# Altium schematic sheet SPI Encoders.SchDoc: Arm - SPI Encoders
size Letter; DrawnBy: N.Chapman, K.Hong; Organization: UW Robotics; Address1: 200 University Avenue; Address2: Waterloo; Address3: Ontario; Address4: Canada N2L 3G6; SheetNumber: 9; SheetTotal: 9
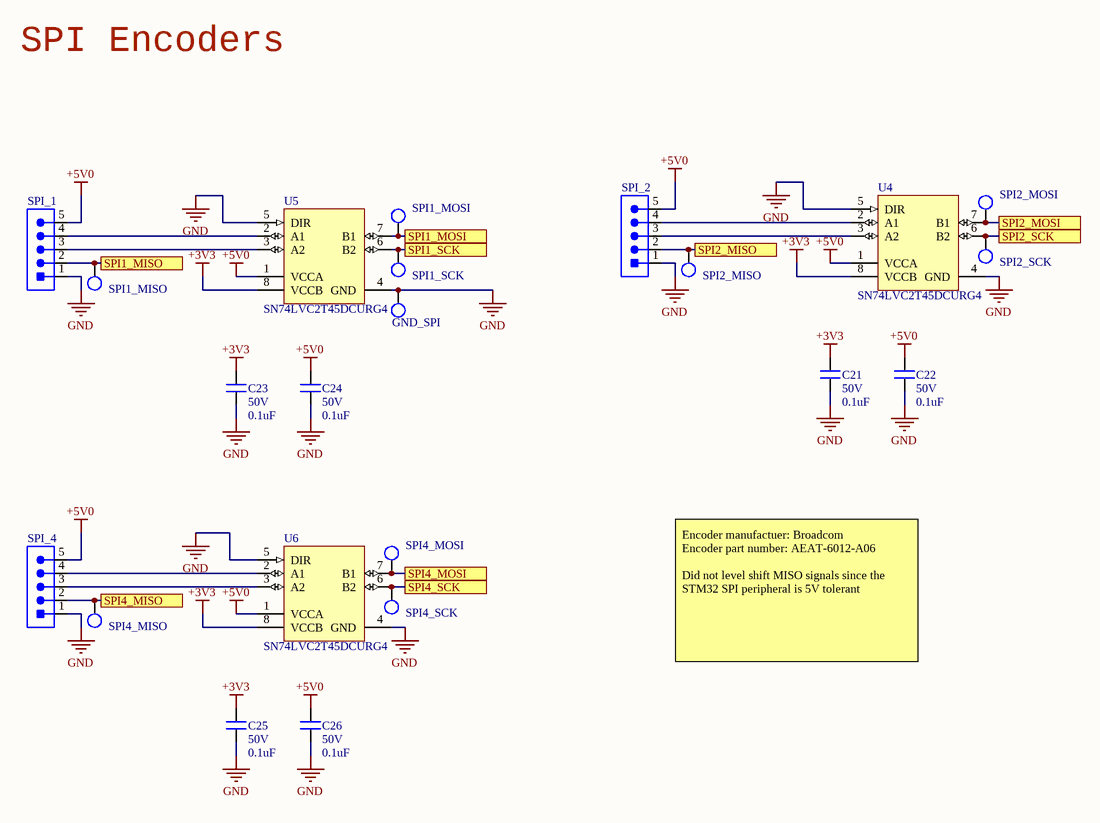
[diagram p0: SPI Encoders.SchDoc]

## Parts
C21  value 0.1uF  Voltage Rating: 50V  [CAPC0603(1608)55_N]  (hidden comment: CAP_0.1uF_50V_0603)
C22  value 0.1uF  Voltage Rating: 50V  [CAPC0603(1608)55_N]  (hidden comment: CAP_0.1uF_50V_0603)
C23  value 0.1uF  Voltage Rating: 50V  [CAPC0603(1608)55_N]  (hidden comment: CAP_0.1uF_50V_0603)
C24  value 0.1uF  Voltage Rating: 50V  [CAPC0603(1608)55_N]  (hidden comment: CAP_0.1uF_50V_0603)
C25  value 0.1uF  Voltage Rating: 50V  [CAPC0603(1608)55_N]  (hidden comment: CAP_0.1uF_50V_0603)
C26  value 0.1uF  Voltage Rating: 50V  [CAPC0603(1608)55_N]  (hidden comment: CAP_0.1uF_50V_0603)
GND_SPI  TESTPOINT_LOOP  [TESTPOINT_LOOP]  (value not drawn)
SPI1_MISO  TESTPOINT_LOOP  [TESTPOINT_LOOP]  (value not drawn)
SPI1_MOSI  TESTPOINT_LOOP  [TESTPOINT_LOOP]  (value not drawn)
SPI1_SCK  TESTPOINT_LOOP  [TESTPOINT_LOOP]  (value not drawn)
SPI2_MISO  TESTPOINT_LOOP  [TESTPOINT_LOOP]  (value not drawn)
SPI2_MOSI  TESTPOINT_LOOP  [TESTPOINT_LOOP]  (value not drawn)
SPI2_SCK  TESTPOINT_LOOP  [TESTPOINT_LOOP]  (value not drawn)
SPI4_MISO  TESTPOINT_LOOP  [TESTPOINT_LOOP]  (value not drawn)
SPI4_MOSI  TESTPOINT_LOOP  [TESTPOINT_LOOP]  (value not drawn)
SPI4_SCK  TESTPOINT_LOOP  [TESTPOINT_LOOP]  (value not drawn)
SPI_1  CON_5M_SM4  [JST-B5B-SM4-TB]  (value not drawn)
SPI_2  CON_5M_SM4  [JST-B5B-SM4-TB]  (value not drawn)
SPI_4  CON_5M_SM4  [JST-B5B-SM4-TB]  (value not drawn)
U4  SN74LVC2T45DCURG4  [DCU0008A_N]
U5  SN74LVC2T45DCURG4  [DCU0008A_N]
U6  SN74LVC2T45DCURG4  [DCU0008A_N]

## Ports
SPI1_MISO, SPI1_MOSI, SPI1_SCK, SPI2_MISO, SPI2_MOSI, SPI2_SCK, SPI4_MISO, SPI4_MOSI, SPI4_SCK

## Nets
+3V3: C21.2 C23.2 C25.2 U4.8(VCCB) U5.8(VCCB) U6.8(VCCB)
+5V0: C22.2 C24.2 C26.2 SPI_1.5 SPI_2.5 SPI_4.5 U4.1(VCCA) U5.1(VCCA) U6.1(VCCA)
GND: C21.1 C22.1 C23.1 C24.1 C25.1 C26.1 GND_SPI.1 SPI_1.1 SPI_2.1 SPI_4.1 U4.4(GND) U4.5(DIR) U5.4(GND) U5.5(DIR) U6.4(GND) U6.5(DIR)
SPI1_MISO: SPI1_MISO.1 SPI_1.2 ; port SPI1_MISO
SPI1_MOSI: SPI1_MOSI.1 U5.7(B1) ; port SPI1_MOSI
SPI1_SCK: SPI1_SCK.1 U5.6(B2) ; port SPI1_SCK
SPI2_MISO: SPI2_MISO.1 SPI_2.2 ; port SPI2_MISO
SPI2_MOSI: SPI2_MOSI.1 U4.7(B1) ; port SPI2_MOSI
SPI2_SCK: SPI2_SCK.1 U4.6(B2) ; port SPI2_SCK
SPI4_MISO: SPI4_MISO.1 SPI_4.2 ; port SPI4_MISO
SPI4_MOSI: SPI4_MOSI.1 U6.7(B1) ; port SPI4_MOSI
SPI4_SCK: SPI4_SCK.1 U6.6(B2) ; port SPI4_SCK
NetSPI_1_3: SPI_1.3 U5.3(A2)
NetSPI_1_4: SPI_1.4 U5.2(A1)
NetSPI_2_3: SPI_2.3 U4.3(A2)
NetSPI_2_4: SPI_2.4 U4.2(A1)
NetSPI_4_3: SPI_4.3 U6.3(A2)
NetSPI_4_4: SPI_4.4 U6.2(A1)

## Notes on the sheet
- SPI Encoders
- Encoder manufactuer: Broadcom
  Encoder part number: AEAT-6012-A06
  Did not level shift MISO signals since the STM32 SPI peripheral is 5V tolerant
- Title
- Size:
- Date:
- Letter
- Drawn By:
- Sheet
- of
- File:

## Library data of the parts
C21-C26 = CAP_0.1uF_50V_0603: CAP CER 0.1UF 50V X7R 0603; MPN: CC0603KRX7R9BB104; Manufacturer: Yageo; Dimensions: 0.063" L x 0.031" W (1.60mm x 0.80mm); Package: 0603 (1608 Metric); Temperature Coefficient: X7R; Supplier Part Number 1: 311-1344-1-ND; Supplier 1: Digi-Key
GND_SPI SPI1_MISO SPI1_MOSI SPI1_SCK SPI2_MISO SPI2_MOSI SPI2_SCK SPI4_MISO SPI4_MOSI SPI4_SCK = TESTPOINT_LOOP: Loop testpoint through-hole pad; Manufacturer: Keystone Electronics; Manufacturer Part Number 1: 5002; Supplier Part Number 1: 36-5002-ND; Supplier 1: Digi-Key
SPI_1 SPI_2 SPI_4 = CON_5M_SM4: CONN HEADER SMD 5POS 2MM; Manufacturer: JST; Manufacturer Part Number: B5B-PH-SM4-TB(LF)(SN); Max Current Rating: 2A; Max Voltage Rating: 100V; Supplier 1: Digi-Key; ComponentLink1URL: https://datasheet.ciiva.com/11749/0900766b80ddea81-11749188.pdf?src-supplier=RSComponents; ComponentLink1Description: https://datasheet.ciiva.com/11749/0900766b80ddea81-11749188.pdf?src-supplier=RSComponents; ComponentLink2URL: https://datasheet.ciiva.com/712/eph-712595.pdf?src-supplier=Digi-Key; ComponentLink2Description: https://datasheet.ciiva.com/712/eph-712595.pdf?src-supplier=Digi-Key; ComponentLink3URL: https://datasheet.ciiva.com/712/eph-712596.pdf?src-supplier=Digi-Key; ComponentLink3Description: https://datasheet.ciiva.com/712/eph-712596.pdf?src-supplier=Digi-Key; ComponentLink4URL: https://datasheet.ciiva.com/730/eph-730612.pdf?src-supplier=Digi-Key; ComponentLink4Description: https://datasheet.ciiva.com/730/eph-730612.pdf?src-supplier=Digi-Key; ComponentLink5URL: https://datasheet.ciiva.com/16344/eph-16344920.pdf?src-supplier=Future+Electronics; ComponentLink5Description: https://datasheet.ciiva.com/16344/eph-16344920.pdf?src-supplier=Future+Electronics; Supplier Part Number 1: 455-1737-1-ND; Pitch: 2mm
U4-U6 = CMP-0859-00013-4: Dual-Bit Dual Supply Transceiver with Configurable Voltage Translation and 3-State Outputs, DCU0008A, LARGE T&R; Manufacturer: Texas Instruments; tpd @ Nom Voltage(Max)(ns): 17.7,10.3,8.3,7.2; Logic: True; Rating: Military; ICC @ Nom Voltage(Max)(mA): 0.004; Bits(#): 2; 3-State Output: Yes; Schmitt Trigger: No; Technology Family: LVC; Sub-Family: Dual Supply Translator; Output Drive (IOL/IOH)(Max)(mA): 32/-32; Output Type: CMOS; VCC(Max)(V): 5.5; Input Type: CMOS/TTL; F @ Nom Voltage(Max)(Mhz): 150; VCC(Min)(V): 1.65; Voltage(Nom)(V): 1.8,2.5,3.3,5; PackageReference: DCU0008A; Generic Part Number: SN74LVC2T45; DatasheetVersion: SCES516J; Operating Temperature Range(C): -40 to 85